# EAGLE design ugly_fpga (EAGLE 8.5.2)
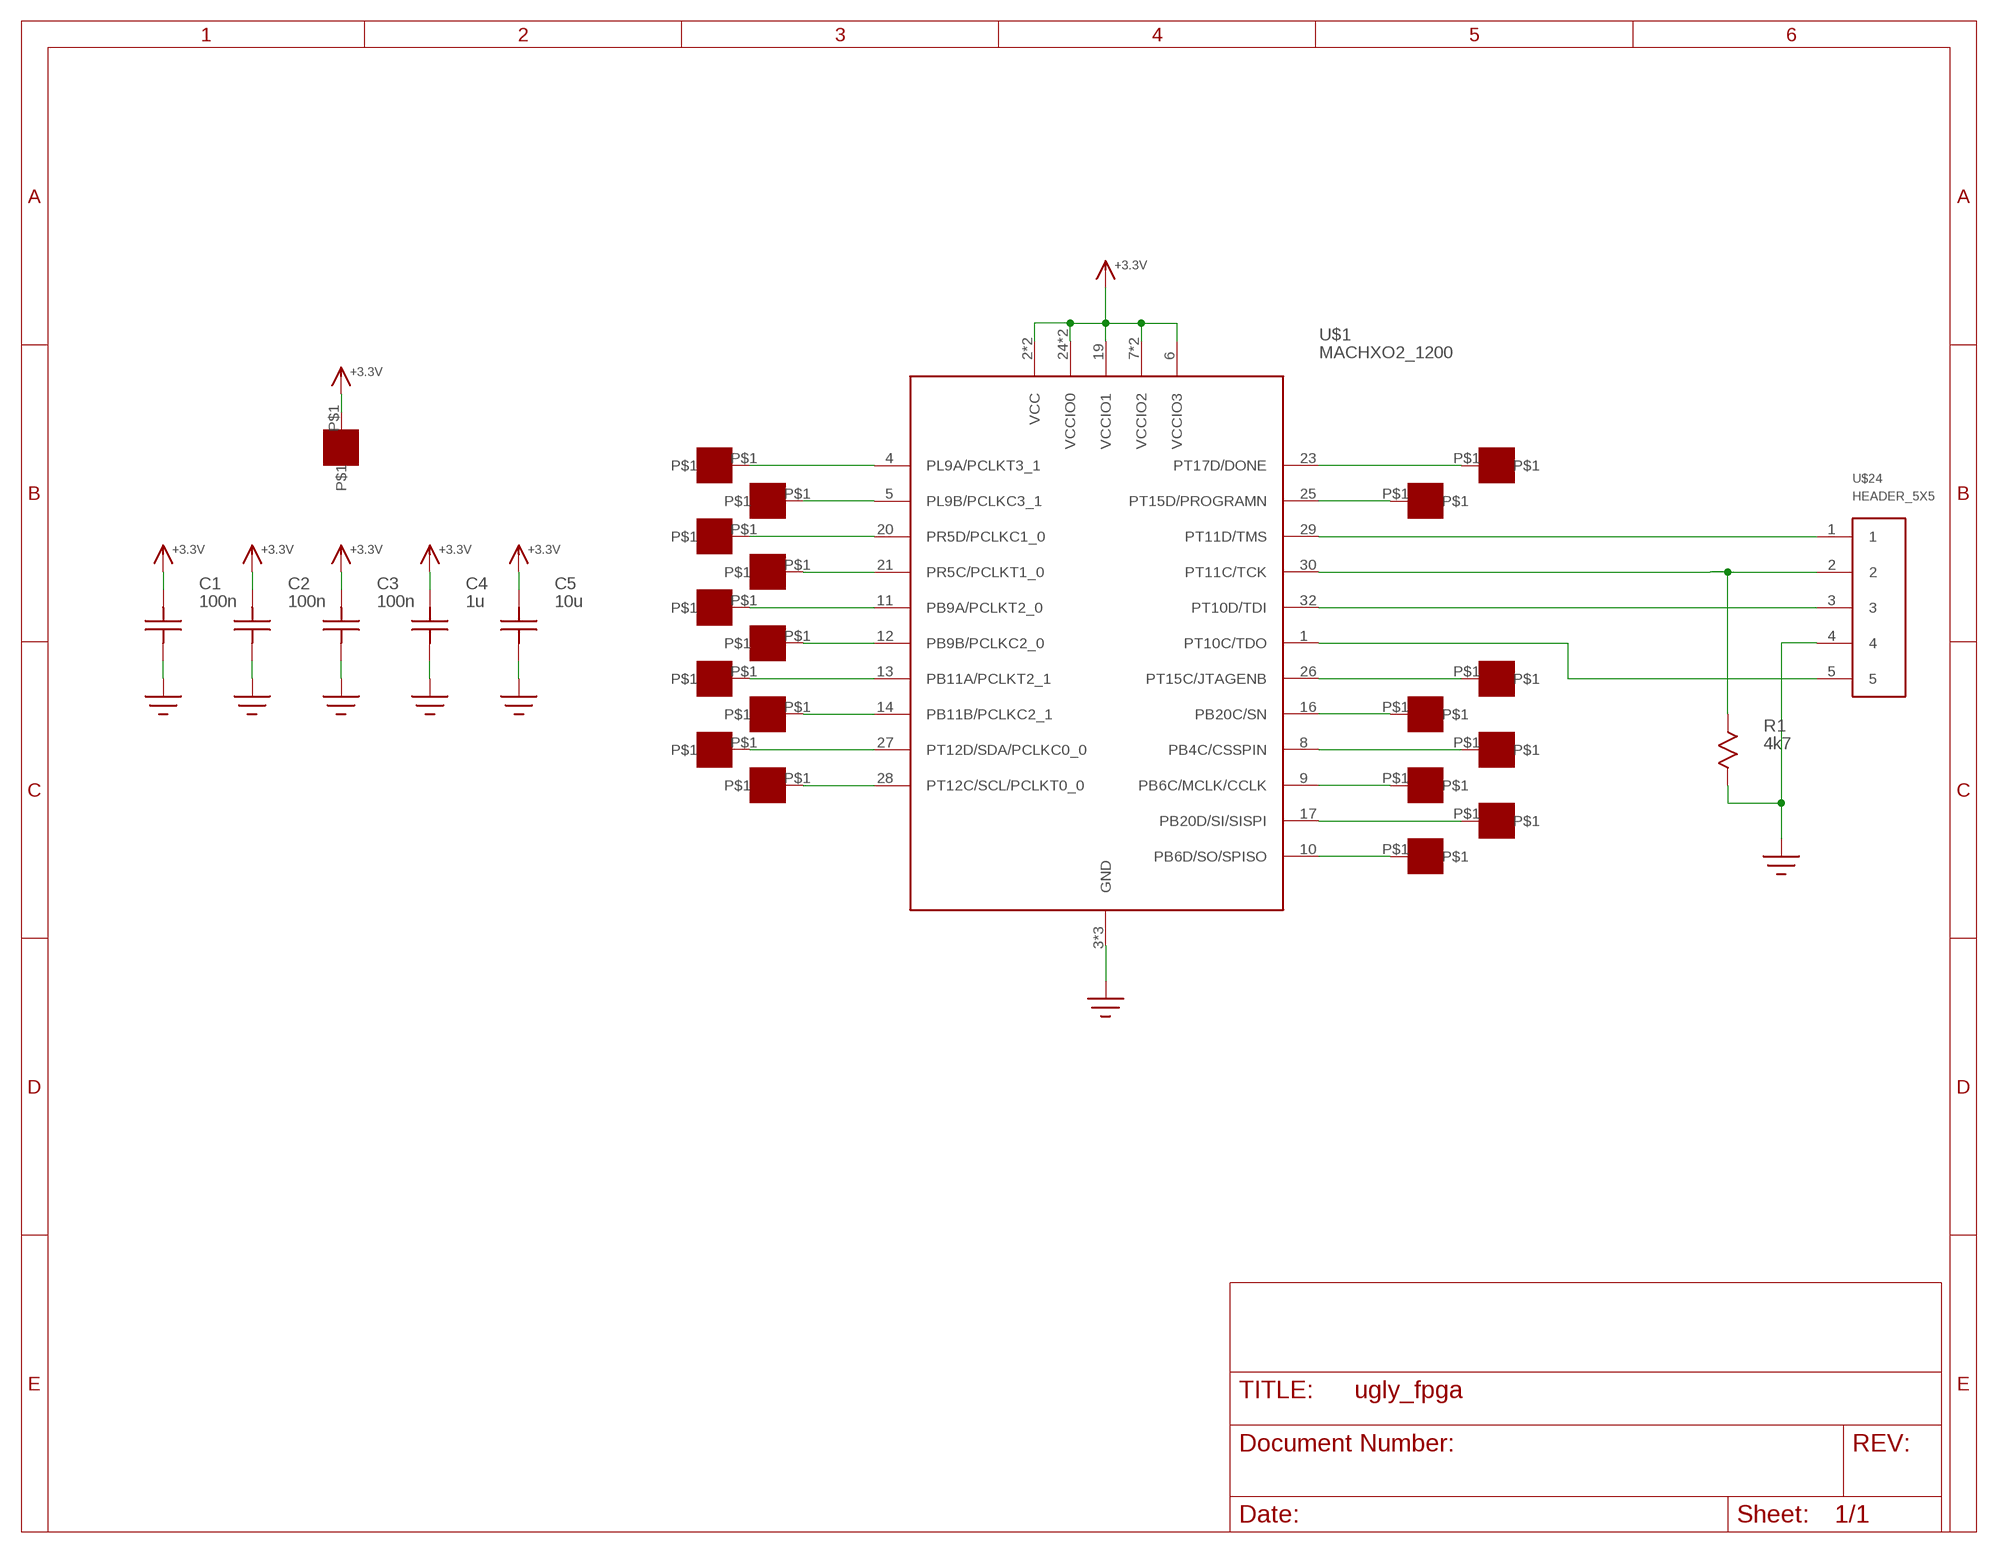
[diagram p0: schematic, sheet 1]

## Parts
C1  100n  C0603  [C0603]
C2  100n  C0603  [C0603]
C3  100n  C0603  [C0603]
C4  1u  C0603  [C0603]
C5  10u  C0603  [C0603]
R1  4k7  R0603  [R0603]
U$1  MACHXO2_1200  [QFN32_5X5]
U$6  PAD50MIL  [PAD_50MIL]
U$7  PAD50MIL  [PAD_50MIL]
U$8  PAD50MIL  [PAD_50MIL]
U$9  PAD50MIL  [PAD_50MIL]
U$10  PAD50MIL  [PAD_50MIL]
U$11  PAD50MIL  [PAD_50MIL]
U$12  PAD50MIL  [PAD_50MIL]
U$13  PAD50MIL  [PAD_50MIL]
U$14  PAD50MIL  [PAD_50MIL]
U$15  PAD50MIL  [PAD_50MIL]
U$16  PAD50MIL  [PAD_50MIL]
U$17  PAD50MIL  [PAD_50MIL]
U$18  PAD50MIL  [PAD_50MIL]
U$19  PAD50MIL  [PAD_50MIL]
U$20  PAD50MIL  [PAD_50MIL]
U$21  PAD50MIL  [PAD_50MIL]
U$22  PAD50MIL  [PAD_50MIL]
U$23  PAD50MIL  [PAD_50MIL]
U$24  HEADER_5X5  [HEADER_SMT_1X5]
U$30  PAD50MIL  [PAD_50MIL]

## Nets
+3.3V: C1.P$2 C2.P$2 C3.P$2 C4.P$2 C5.P$2 U$1.2(VCC) U$1.6(VCCIO3) U$1.7(VCCIO2) U$1.15(VCCIO2) U$1.18(VCC) U$1.19(VCCIO1) U$1.24(VCCIO0) U$1.31(VCCIO0) U$30.P$1
GND: C1.P$1 C2.P$1 C3.P$1 C4.P$1 C5.P$1 R1.P$2 U$1.3(GND) U$1.22(GND) U$1.PAD(GND) U$24.4
N$1: U$1.4(PL9A/PCLKT3_1) U$6.P$1
N$2: U$1.5(PL9B/PCLKC3_1) U$7.P$1
N$3: U$1.20(PR5D/PCLKC1_0) U$8.P$1
N$4: U$1.21(PR5C/PCLKT1_0) U$9.P$1
N$5: U$1.11(PB9A/PCLKT2_0) U$10.P$1
N$6: U$1.12(PB9B/PCLKC2_0) U$11.P$1
N$7: U$1.13(PB11A/PCLKT2_1) U$12.P$1
N$8: U$1.14(PB11B/PCLKC2_1) U$13.P$1
N$9: U$1.27(PT12D/SDA/PCLKC0_0) U$14.P$1
N$10: U$1.28(PT12C/SCL/PCLKT0_0) U$15.P$1
N$11: U$1.23(PT17D/DONE) U$22.P$1
N$12: U$1.25(PT15D/PROGRAMN) U$23.P$1
N$13: U$1.26(PT15C/JTAGENB) U$21.P$1
N$14: U$1.16(PB20C/SN) U$20.P$1
N$15: U$1.8(PB4C/CSSPIN) U$19.P$1
N$16: U$1.9(PB6C/MCLK/CCLK) U$18.P$1
N$17: U$1.17(PB20D/SI/SISPI) U$17.P$1
N$18: U$1.10(PB6D/SO/SPISO) U$16.P$1
N$19: U$1.29(PT11D/TMS) U$24.1
N$20: R1.P$1 U$1.30(PT11C/TCK) U$24.2
N$21: U$1.32(PT10D/TDI) U$24.3
N$22: U$1.1(PT10C/TDO) U$24.5

## Library data of the parts
C1-C5 = ugly_fpga:C
R1 = ugly_fpga:R
U$1 = ugly_fpga:MACHXO2_1200
U$6-U$23 U$30 = ugly_fpga:PAD
U$24 = ugly_fpga:HEADER_5X5

## Board
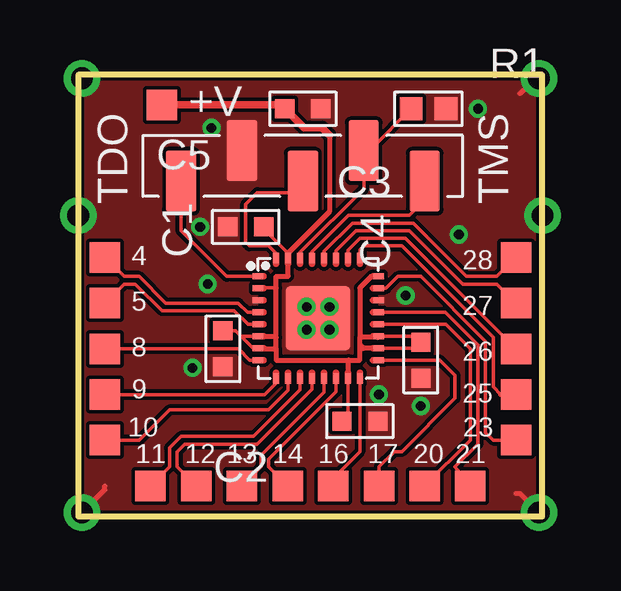
[diagram p1: board, top side]
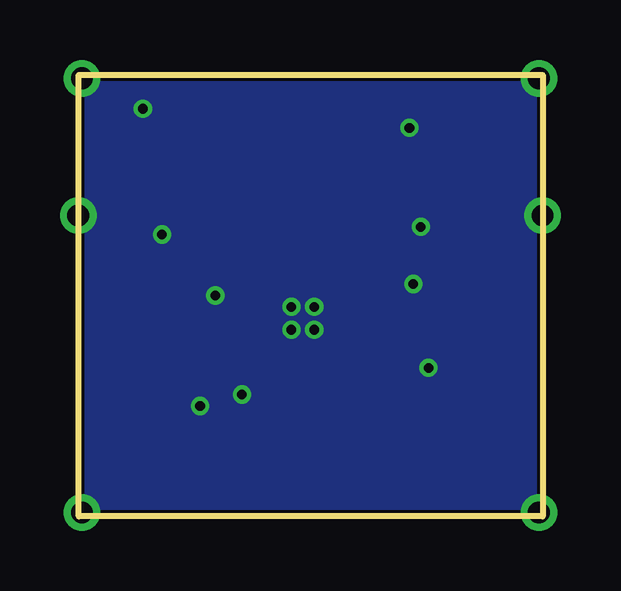
[diagram p2: board, bottom side, seen from below]

Size 19.35 x 18.4 mm. Coordinates in mm from the lower left corner, seen from the top.
Outline: 0,0 19.35,0 19.35,18.4 0,18.4 0,0
Copper layers (1*16): Top 0.0356mm / dielectric 1.5011mm / Bottom 0.0356mm
Design rules "LaenPCBOrder *": minimum track width 6mil, minimum drill 13mil, track to track 6mil, track to pad 6mil, pad to pad 6mil, via to via 6mil, smd to smd 6mil, copper to edge 5mil, drill to drill 6mil, minimum pad ring 7mil, minimum via ring 7mil, stop-mask expansion 3mil, vias tented up to drill 0mil, thermal gap 10mil

### Footprints (pad centres in the part's own frame; a part is rotated, then mirrored left to right if it is on the bottom)
C0603 = smd 0.8 x 0.8: P$1 -0.75,0; P$2 0.75,0
R0603 = smd 0.95 x 0.95: P$1 -0.725,0; P$2 0.725,0
QFN32_5X5 = smd 0.438 x 0.24: 1 -2.513,1.75; 2 -2.513,1.25; 3 -2.513,0.75; 4 -2.513,0.25; 5 -2.513,-0.25; 6 -2.513,-0.75; 7 -2.513,-1.25; 8 -2.513,-1.75; 17 2.538,-1.75; 18 2.538,-1.25; 19 2.538,-0.75; 20 2.538,-0.25; 21 2.538,0.25; 22 2.538,0.75; 23 2.538,1.25; 24 2.538,1.75 | smd 0.24 x 0.438: 9 -1.75,-2.513; 10 -1.25,-2.513; 11 -0.75,-2.513; 12 -0.25,-2.513; 13 0.25,-2.513; 14 0.75,-2.513; 15 1.25,-2.513; 16 1.75,-2.513; 25 1.75,2.513; 26 1.25,2.513; 27 0.75,2.513; 28 0.25,2.513; 29 -0.25,2.513; 30 -0.75,2.513; 31 -1.25,2.513; 32 -1.75,2.513 | smd 2.7 x 2.7: PAD 0,0
PAD_50MIL = smd 1.27 x 1.27: P$1 0,0
HEADER_SMT_1X5 = smd 1.27 x 2.54: 1 -5.08,0.635; 2 -2.54,-0.635; 3 0,0.635; 4 2.54,-0.635; 5 5.08,0.635

### Placement (x,y rotation side)
C1  6.03,6.99 90 top
C2  11.75,3.97 180 top
C3  6.99,12.06 0 top
C4  14.29,6.51 90 top
C5  9.37,16.99 180 top
R1  14.61,16.99 0 top
U$1  10,8.26 0 top
U$6  1.11,10.79 0 top
U$7  1.11,8.89 0 top
U$8  14.45,1.27 0 top
U$9  16.35,1.27 0 top
U$10  3.02,1.27 0 top
U$11  4.92,1.27 0 top
U$12  6.83,1.27 0 top
U$13  8.73,1.27 0 top
U$14  18.26,8.89 0 top
U$15  18.26,10.79 0 top
U$16  1.11,3.17 0 top
U$17  12.54,1.27 0 top
U$18  1.11,5.08 0 top
U$19  1.11,6.99 0 top
U$20  10.64,1.27 0 top
U$21  18.26,6.99 0 top
U$22  18.26,3.17 0 top
U$23  18.26,5.08 0 top
U$24  9.37,14.61 180 top
U$30  3.49,17.14 0 top

### Tracks (layer width: path | path; a pad name or v marks a point on that pad's centre or on a via)
+3.3V
  Top 0.152: U$1.7 7.28,7 6.78,7.5 | C1.P$2 6.55,7.74 6.78,7.5 | U$1.2 7.51,9.53 8.26,9.53 | C2.P$2 11.25,4.06 U$1.15 | U$1.19 14.04,7.5 C4.P$2 14.03,7 U$1.18 | U$1.6 6.78,7.5 | 8.46,17.14 C5.P$2 | U$1.31 8.75,10.97 7.74,11.99 C3.P$2
  Top 0.203: U$1.15 11.27,5.76 11.27,6.51 | 11.27,6.51 11.75,6.51 11.75,7.14 | 8.26,6.99 8.26,6.51 11.27,6.51 | 11.75,7.14 11.75,7.46 | U$1.7 7.51,6.99 8.26,6.99 | 8.26,6.99 8.26,7.46 | 8.26,7.46 8.26,9.53 8.26,10 8.73,10 8.75,10.02 U$1.31 | U$1.6 8.21,7.5 8.26,7.46 | U$1.19 12.49,7.46 11.75,7.46 | U$1.18 11.89,7 11.75,7.14 | U$1.24 12.23,10.01 11.75,9.53 11.75,7.46 | 10.48,15.88 10.48,12.7 8.75,10.97
  Top 0.305: U$30.P$1 8.46,17.14 | C5.P$2 9.41,16.19 10.16,16.19 10.48,15.88
GND  (via drill 0.4, 0.9 pad 1.52)
  Top 0.203: 0,0 1.11,1.11 1.11,1.27 | 19.37,0 18.41,0.95 18.26,0.95 | 19.37,18.41 19.21,18.41 18.41,17.62
  other vias: 4.76,6.19 12.54,5.08 5.08,12.06 14.29,4.6 9.53,8.73 10.48,8.73 10.48,7.78 9.53,7.78 13.65,9.21 5.4,9.68 16.67,16.99 15.88,11.75 5.56,16.19 0,12.54 19.37,12.54 0.16,0.16 19.21,0.16 19.21,18.26 0.16,18.26
  pour Top (no thermals): 0,0 19.37,0 19.37,18.41 0,18.41
  pour Bottom (no thermals): 0,0 19.37,0 19.37,18.41 0,18.41
N$1
  Top 0.152: U$1.4 7.05,8.51 6.67,8.89 3.65,8.89 2.54,10 1.91,10 U$6.P$1
N$2
  Top 0.152: U$1.5 7.08,8.01 6.51,8.57 3.49,8.57 2.38,9.68 1.91,9.68 U$7.P$1
N$3
  Top 0.152: U$1.20 15.33,8.01 16.35,6.99 16.35,3.17 U$8.P$1
N$4
  Top 0.152: U$1.21 15.31,8.51 16.67,7.14 16.67,3.02 15.72,2.06 U$9.P$1
N$5
  Top 0.152: U$1.11 9.25,5.28 7.3,3.33 4.29,3.33 3.81,2.86 3.81,2.06 U$10.P$1
N$6
  Top 0.152: U$1.12 9.75,5.31 7.46,3.02 4.45,3.02 4.13,2.7 4.13,2.06 U$11.P$1
N$7
  Top 0.152: U$1.13 10.25,5.17 7.62,2.54 7.62,2.06 U$12.P$1
N$8
  Top 0.152: U$1.14 10.75,5.2 7.94,2.38 7.94,2.06 U$13.P$1
N$9
  Top 0.152: U$1.27 10.75,11.07 11.59,11.91 13.81,11.91 16.03,9.68 17.46,9.68 U$14.P$1
N$10
  Top 0.152: U$1.28 10.25,11.04 11.43,12.22 13.97,12.22 16.19,10 17.46,10 U$15.P$1
N$11
  Top 0.152: U$22.P$1 17.3,3.17 16.99,3.49 16.99,7.3 14.29,10 13.34,10 12.84,9.51 U$1.23
N$12
  Top 0.152: 17.62,5.08 17.3,5.4 17.3,7.46 13.49,11.27 11.91,11.27 11.75,11.12 U$1.25
  Top 0.203: U$23.P$1 17.62,5.08
N$13
  Top 0.152: U$21.P$1 13.65,11.59 11.75,11.59 11.25,11.09 U$1.26
N$14
  Top 0.152: U$1.16 11.75,2.7 10.64,1.59 U$20.P$1
N$15
  Top 0.152: U$1.8 7.14,6.51 6.69,6.99 U$19.P$1
  Top 0.203: U$1.8
N$16
  Top 0.152: U$1.9 8.25,5.55 7.78,5.08 U$18.P$1
N$17
  Top 0.152: U$1.17 15.08,6.51 15.72,5.87 15.72,4.92 13.49,2.7 13.18,2.7 12.54,2.06 U$17.P$1
N$18
  Top 0.152: 8.73,5.74 U$1.10 8.75,5.26 7.94,4.45 3.81,4.45 2.54,3.17 U$16.P$1
N$19
  Top 0.152: U$1.29 9.75,11.02 11.27,12.54 13.81,12.54 14.45,13.18
  Top 0.203: 14.45,13.18 U$24.1
N$20
  Top 0.152: U$1.30 9.25,11 11.91,13.65 11.91,14.29 | R1.P$1 12.22,15.33 11.91,15.33
  Top 0.203: 11.91,14.13 11.91,14.29 U$24.2 11.91,15.33
N$21
  Top 0.152: U$1.32 8.25,10.96 7.94,11.27 7.14,11.27 6.99,11.43 6.99,13.02 7.46,13.49 8.89,13.49 U$24.3
N$22
  Top 0.152: U$1.1 6.19,10.01 4.29,11.91 U$24.5

### Text on the board
tPlace: +V | TDO | TMS | 28 | 4 | 5 | 27 | 8 | 26 | 25 | 9 | 10 | 23 | 11 | 12 | 13 | 14 | 16 | 17 | 20 | 21